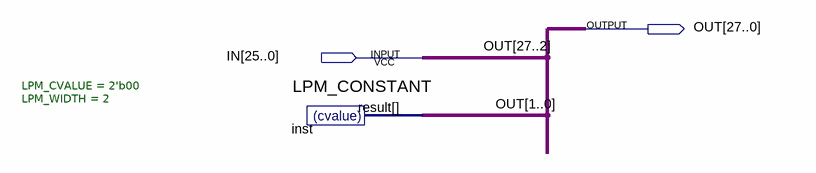
[diagram p0: schematic sheet]
// Quartus schematic leftShift26.bdf as structural Verilog: 1 symbols, 2 pins
module leftShift26 (
  input  [25:0] IN,
  output [27:0] OUT
);

  LPM_CONSTANT #(.LPM_CVALUE(2'b00), .LPM_WIDTH(2)) inst (.result(OUT[1:0]));

  assign OUT[27:2] = IN;
endmodule
